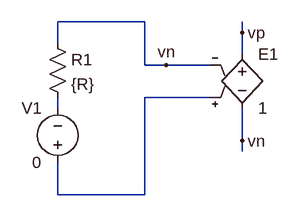
[diagram p0: schematic vnoise.asc]
vnoise.asc, the LTspice schematic file:
Version 4
SHEET 1 880 680
WIRE 0 144 -128 144
WIRE 144 160 144 144
WIRE -128 176 -128 144
WIRE 144 192 144 160
WIRE 0 208 0 144
WIRE 32 208 0 208
WIRE 96 208 32 208
WIRE 96 256 0 256
WIRE -128 272 -128 256
WIRE 144 320 144 272
WIRE 144 336 144 320
WIRE -128 400 -128 352
WIRE 0 400 0 256
WIRE 0 400 -128 400
FLAG 144 160 vp
FLAG 144 320 vn
FLAG 32 208 vn
SYMBOL res -144 160 R0
SYMATTR InstName R1
SYMATTR Value {R}
SYMBOL voltage -128 368 R180
WINDOW 0 24 96 Left 2
WINDOW 3 24 16 Left 2
WINDOW 123 0 0 Left 2
WINDOW 39 0 0 Left 2
SYMATTR InstName V1
SYMATTR Value 0
SYMBOL e2 144 176 R0
SYMATTR InstName E1
SYMATTR Value 1

The netlist it stands for:
* vnoise.asc
R1 vn N002 {R}
V1 N001 N002 0
E1 vp vn N001 vn 1
.backanno
.end